# EAGLE design master_jorge3newIMU (EAGLE 7.1.0)
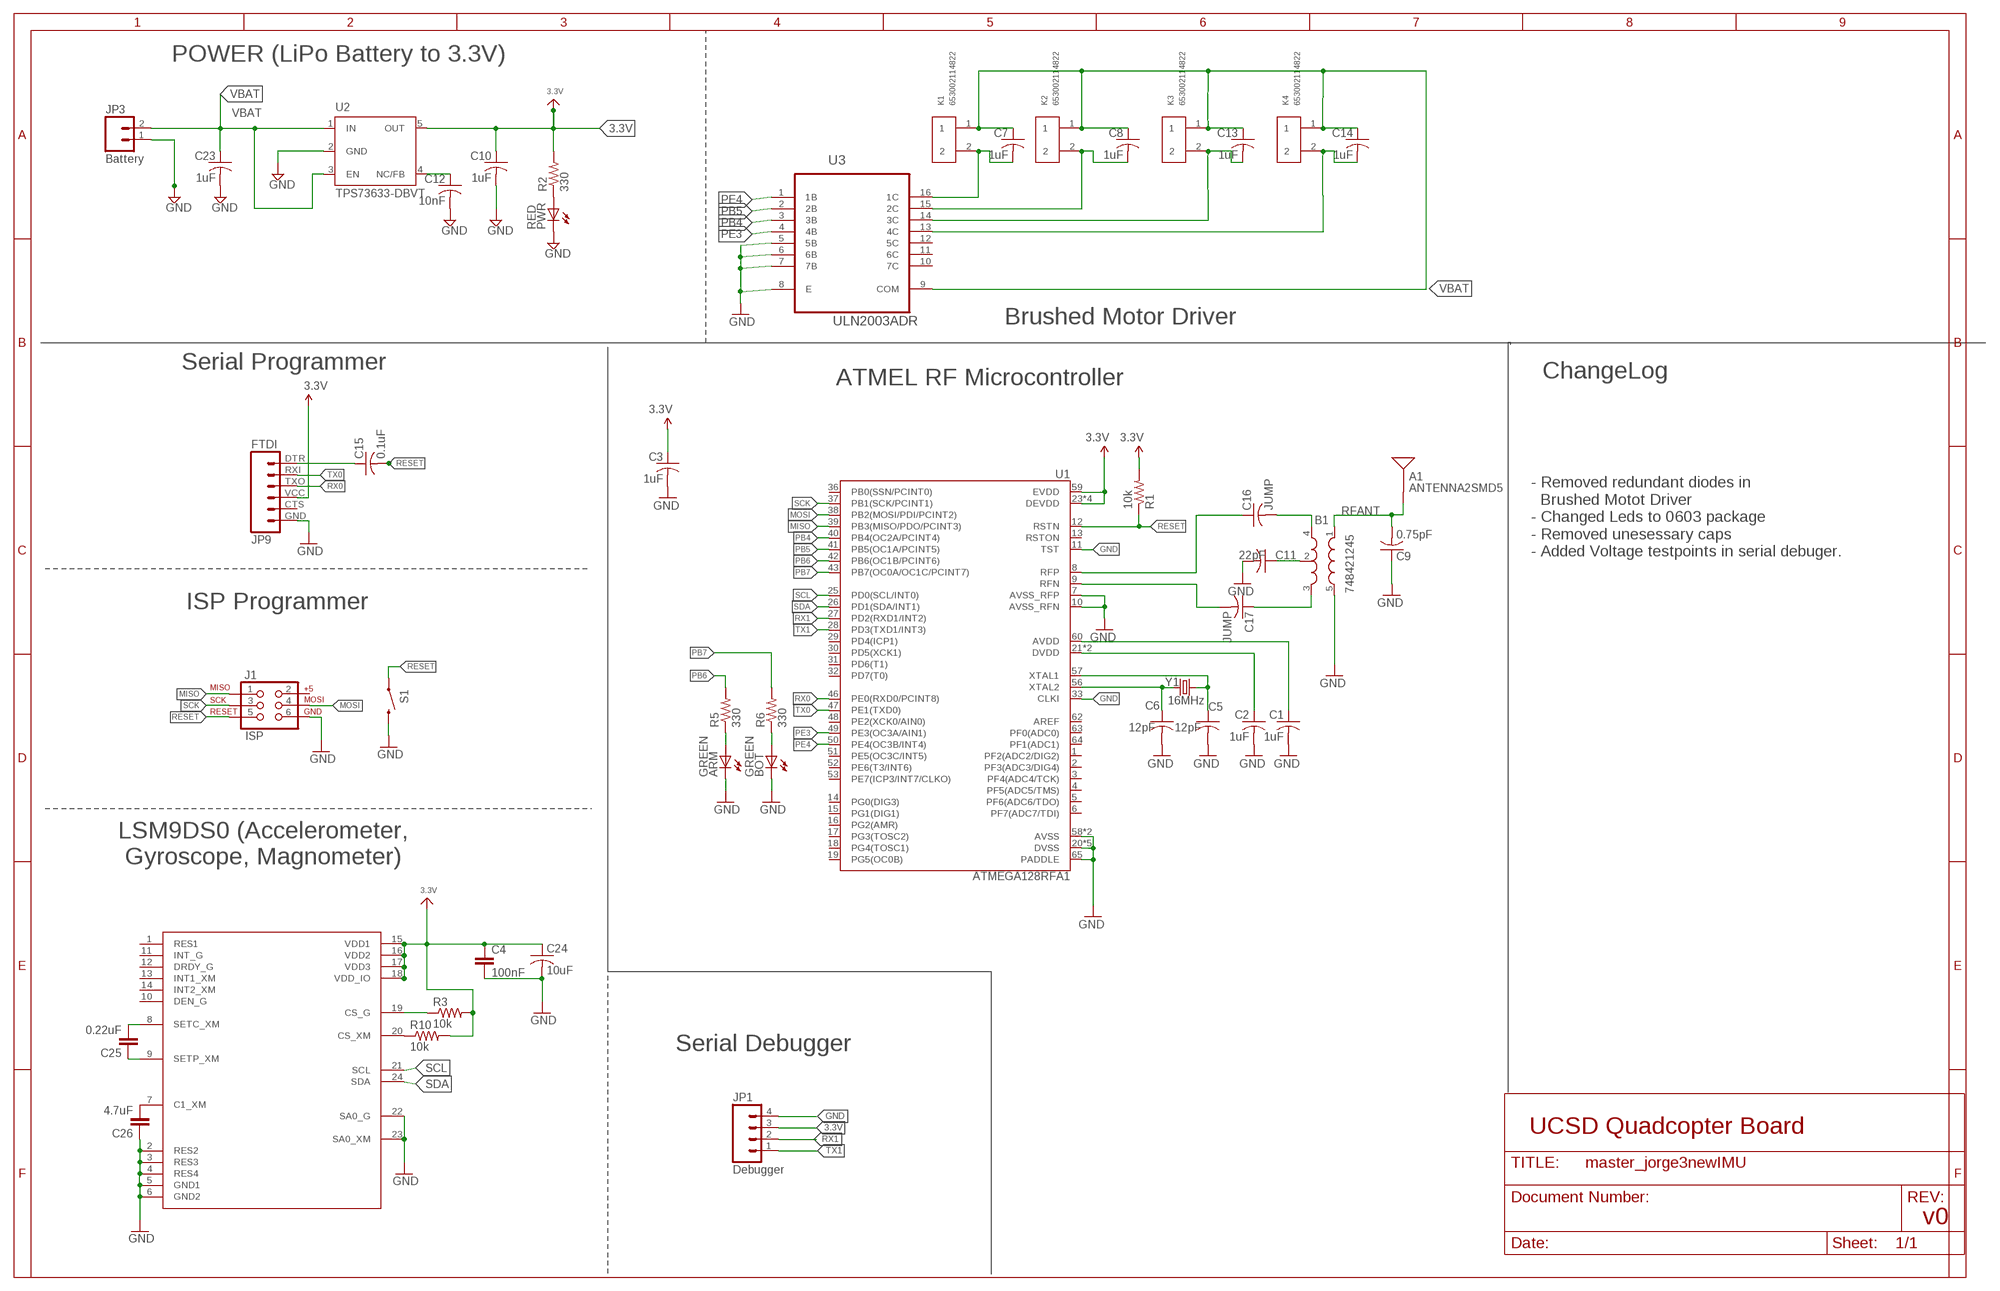
[diagram p0: schematic, sheet 1]

## Parts
A1  ANTENNA2SMD5  [ANTENNA-CHIP5]
ARM  GREEN  LEDCHIP-LED0805  [CHIP-LED0805]
B1  748421245  BALUN0805  [BALUN]
BOT  GREEN  LEDCHIP-LED0805  [CHIP-LED0805]
C1  1uF  C-USC0805  [C0805]
C2  1uF  C-USC0805  [C0805]
C3  1uF  C-USC0805  [C0805]
C4  100nF  CAP0805  [0805]
C5  12pF  C-USC0805  [C0805]
C6  12pF  C-USC0805  [C0805]
C7  1uF  C-USC0805  [C0805]
C8  1uF  C-USC0805  [C0805]
C9  0.75pF  C-USC0805  [C0805]
C10  1uF  C-USC0805  [C0805]
C11  22pF  C-USC0805  [C0805]
C12  10nF  C-USC0805  [C0805]
C13  1uF  C-USC0805  [C0805]
C14  1uF  C-USC0805  [C0805]
C15  0.1uF  C-USC0805  [C0805]
C16  JUMP  C-USC0805  [C0805]
C17  JUMP  C-USC0805  [C0805]
C23  1uF  C-USC0805  [C0805]
C24  10uF  C-USC0805  [C0805]
C25  0.22uF  CAP0805  [0805]
C26  4.7uF  CAP0805  [0805]
J1  ISP  AVR_SPI_PRG_6NS  [2X3-NS]
JP1  Debugger  M04PTH  [1X04]
JP3  Battery  M02PTH  [1X02]
JP9  FTDI  FTDI_BASICPTH  [FTDI_BASIC]
K1  653002114822  [653002114822]
K2  653002114822  [653002114822]
K3  653002114822  [653002114822]
K4  653002114822  [653002114822]
PWR  RED  LEDCHIP-LED0805  [CHIP-LED0805]
R1  10k  R-US_R0805  [R0805]
R2  330  R-US_R0805  [R0805]
R3  10k  RESISTOR0805-RES  [0805]
R5  330  R-US_R0805  [R0805]
R6  330  R-US_R0805  [R0805]
R10  10k  RESISTOR0805-RES  [0805]
S1  SWITCH-MOMENTARY-2SMD  [TACTILE_SWITCH_SMD]
U1  ATMEGA128RFA1  [QFN-64]
U2  TPS73633-DBVT  [SOT23-DBV]
U3  ULN2003ADR  [SOIC127P600X175-16N]
U4  LSM9DS0  [LGA-24]
Y1  16MHz  CRYSTAL5X3  [CRYSTAL-SMD-5X3]

## Nets
3.3V: C3.1 C4.1 C10.1 C24.1 JP1.3 JP9.VCC R1.2 R2.2 R3.2 R10.2 U1.23(DEVDD) U1.34(DEVDD) U1.44(DEVDD) U1.54(DEVDD) U1.59(EVDD) U2.5(OUT) U4.15(VDD1) U4.16(VDD2) U4.17(VDD3) U4.18(VDD_IO)
AVDD: C1.1 U1.60(AVDD)
DTR: C15.1 JP9.DTR
DVDD: C2.1 U1.21(DVDD) U1.22(DVDD)
GND: ARM.C B1.5(GND) BOT.C C1.2 C2.2 C3.2 C4.2 C5.2 C6.2 C9.1 C10.2 C11.2 C12.2 C23.2 C24.2 C26.1 J1.6 JP1.4 JP3.1 JP9.GND PWR.C S1.3 U1.7(AVSS_RFP) U1.10(AVSS_RFN) U1.11(TST) U1.20(DVSS) U1.24(DVSS) U1.33(CLKI) U1.35(DVSS) U1.45(DVSS) U1.55(DVSS) U1.58(AVSS) U1.61(AVSS) U1.65(PADDLE) U2.2(GND) U3.5(5B) U3.6(6B) U3.7(7B) U3.8(E) U4.2(RES2) U4.3(RES3) U4.4(RES4) U4.5(GND1) U4.6(GND2) U4.22(SA0_G) U4.23(SA0_XM)
MISO: J1.1 U1.39(PB3(MISO/PDO/PCINT3))
MOSI: J1.4 U1.38(PB2(MOSI/PDI/PCINT2))
N$1: C12.1 U2.4(NC/FB)
N$2: PWR.A R2.1
N$3: C5.1 U1.57(XTAL1) Y1.3
N$4: C6.1 U1.56(XTAL2) Y1.1
N$7: B1.2(GND) C11.1
N$8: ARM.A R5.1
N$10: B1.4(OUT1) C16.2
N$11: B1.3(OUT2) C17.1
N$13: BOT.A R6.1
N$20: C26.2 U4.7(C1_XM)
N$21: C25.2 U4.8(SETC_XM)
N$22: C25.1 U4.9(SETP_XM)
N$23: R3.1 U4.19(CS_G)
N$24: R10.1 U4.20(CS_XM)
N$29: C7.2 K1.2 U3.16(1C)
N$30: C8.2 K2.2 U3.15(2C)
N$31: C13.2 K3.2 U3.14(3C)
N$32: C14.2 K4.2 U3.13(4C)
PB4: U1.40(PB4(OC2A/PCINT4)) U3.3(3B)
PB5: U1.41(PB5(OC1A/PCINT5)) U3.2(2B)
PB6: R5.2 U1.42(PB6(OC1B/PCINT6))
PB7: R6.2 U1.43(PB7(OC0A/OC1C/PCINT7))
PE3: U1.49(PE3(OC3A/AIN1)) U3.4(4B)
PE4: U1.50(PE4(OC3B/INT4)) U3.1(1B)
RESET: C15.2 J1.5 R1.1 S1.1 U1.12(RSTN)
RFANT [RFSIG]: A1.FEED(SIGNAL) B1.1(IN) C9.2
RFN: C17.2 U1.9(RFN)
RFP: C16.1 U1.8(RFP)
RX0: JP9.TXO U1.46(PE0(RXD0/PCINT8))
RX1: JP1.2 U1.27(PD2(RXD1/INT2))
SCK: J1.3 U1.37(PB1(SCK/PCINT1))
SCL: U1.25(PD0(SCL/INT0)) U4.21(SCL)
SDA: U1.26(PD1(SDA/INT1)) U4.24(SDA)
TX0: JP9.RXI U1.47(PE1(TXD0))
TX1: JP1.1 U1.28(PD3(TXD1/INT3))
VBAT: C7.1 C8.1 C13.1 C14.1 C23.1 JP3.2 K1.1 K2.1 K3.1 K4.1 U2.1(IN) U2.3(EN) U3.9(COM)
Unconnected: J1.2 JP9.CTS U1.1(PF2(ADC2/DIG2)) U1.2(PF3(ADC3/DIG4)) U1.3(PF4(ADC4/TCK)) U1.4(PF5(ADC5/TMS)) U1.5(PF6(ADC6/TDO)) U1.6(PF7(ADC7/TDI)) U1.13(RSTON) U1.14(PG0(DIG3)) U1.15(PG1(DIG1)) U1.16(PG2(AMR)) U1.17(PG3(TOSC2)) U1.18(PG4(TOSC1)) U1.19(PG5(OC0B)) U1.29(PD4(ICP1)) U1.30(PD5(XCK1)) U1.31(PD6(T1)) U1.32(PD7(T0)) U1.36(PB0(SSN/PCINT0)) U1.48(PE2(XCK0/AIN0)) U1.51(PE5(OC3C/INT5)) U1.52(PE6(T3/INT6)) U1.53(PE7(ICP3/INT7/CLKO)) U1.62(AREF) U1.63(PF0(ADC0)) U1.64(PF1(ADC1)) U3.10(7C) U3.11(6C) U3.12(5C) U4.1(RES1) U4.10(DEN_G) U4.11(INT_G) U4.12(DRDY_G) U4.13(INT1_XM) U4.14(INT2_XM)

## Notes on the sheet
- POWER (LiPo Battery to 3.3V)
- Brushed Motor Driver
- Serial Programmer
- ATMEL RF Microcontroller | ChangeLog
- - Removed redundant diodes in 
    Brushed Motot Driver
  - Changed Leds to 0603 package
  - Removed unesessary caps
  - Added Voltage testpoints in serial debuger.
- ISP Programmer
- LSM9DS0 (Accelerometer,
   Gyroscope, Magnometer)
- Serial Debugger
- UCSD Quadcopter Board
- v0

## Library data of the parts
A1 = SparkFun-RF:ANTENNA2: Chip antenna Single endded antenna. Common with smaller chip antennas. CHIP4 package is the GPS Chip Antenna SKU: GPS-08418. CHIP5 package is 2.4GHz chip antenna SKU: WRL-00144.
ARM BOT PWR = led:LED: LED OSRAM: - CHIPLED LG R971, LG N971, LY N971, LG Q971, LY Q971, LO R971, LY R971 LH N974, LH R974 LS Q976, LO Q976, LY Q976 LO Q996 - Hyper CHIPLED LW Q18S LB Q993, LB Q99A, LB R99A - SideLED LS A670, LO A670, LY A670, LG A670, LP A670 LB A673, LV A673, LT A673, LW A673 LH A674 LY A675 LS A676, LA A676, LO A676, LY A676, LW A676 LS A679, LY A679, LG A679 - Hyper Micro SIDELED® LS Y876, LA Y876, LO Y876, LY Y876 LT Y87S - SmartLED LW L88C, LW L88S LB L89C, LB L89S, LG L890 LS L89K, LO L89K, LY L89K LS L896, LA L896, LO L896, LY L896 - TOPLED LS T670, LO T670, LY T670, LG T670, LP T670 LSG T670, LSP T670, LSY T670, LOP T670, LYG T670 LG T671, LOG T671, LSG T671 LB T673, LV T673, LT T673, LW T673 LH T674 LS T676, LA T676, LO T676, LY T676, LB T676, LH T676, LSB T676, LW T676 LB T67C, LV T67C, LT T67C, LS T67K, LO T67K, LY T67K, LW E67C LS E67B, LA E67B, LO E67B, LY E67B, LB E67C, LV E67C, LT E67C LW T67C LS T679, LY T679, LG T679 LS T770, LO T770, LY T770, LG T770, LP T770 LB T773, LV T773, LT T773, LW T773 LH T774 LS E675, LA E675, LY E675, LS T675 LS T776, LA T776, LO T776, LY T776, LB T776 LHGB T686 LT T68C, LB T68C - Hyper Mini TOPLED® LB M676 - Mini TOPLED Santana® LG M470 LS M47K, LO M47K, LY M47K Source: http://www.osram.convergy.de LUXEON: - LUMILED® LXK2-PW12-R00, LXK2-PW12-S00, LXK2-PW14-U00, LXK2-PW14-V00 LXK2-PM12-R00, LXK2-PM12-S00, LXK2-PM14-U00 LXK2-PE12-Q00, LXK2-PE12-R00, LXK2-PE12-S00, LXK2-PE14-T00, LXK2-PE14-U00 LXK2-PB12-K00, LXK2-PB12-L00, LXK2-PB12-M00, LXK2-PB14-N00, LXK2-PB14-P00, LXK2-PB14-Q00 LXK2-PR12-L00, LXK2-PR12-M00, LXK2-PR14-Q00, LXK2-PR14-R00 LXK2-PD12-Q00, LXK2-PD12-R00, LXK2-PD12-S00 LXK2-PH12-R00, LXK2-PH12-S00 LXK2-PL12-P00, LXK2-PL12-Q00, LXK2-PL12-R00 Source: www.luxeon.com KINGBRIGHT: KA-3528ASYC Source: www.kingbright.com
B1 = SparkFun-RF:BALUN: 0805 footprint balun- Ember 351/357
C1-C3 C5-C17 C23 = resistor:C-US: CAPACITOR, American symbol
C4 C25 C26 = SparkFun-Capacitors:CAP: Capacitor Standard 0603 ceramic capacitor, and 0.1" leaded capacitor.
C24 = rcl:C-US: CAPACITOR, American symbol
J1 = SparkFun-Connectors:AVR_SPI_PRG_6: AVR ISP 6 Pin This is the reduced ISP connector for AVR programming. Common on Arduino. This footprint will take up less PCB space and can be used with a 10-pin to 6-pin adapter such as SKU: BOB-08508
JP1 = SparkFun-Connectors:M04: Header 4 Standard 4-pin 0.1" header. Use with straight break away headers (SKU : PRT-00116), right angle break away headers (PRT-00553), swiss pins (PRT-00743), machine pins (PRT-00117), and female headers (PRT-00115). Molex polarized connector foot print use with SKU : PRT-08231 with associated crimp pins and housings. 1MM SMD Version SKU: PRT-10208
JP3 = SparkFun:M02: Header 2 Standard 2-pin 0.1" header. Use with straight break away headers (SKU : PRT-00116), right angle break away headers (PRT-00553), swiss pins (PRT-00743), machine pins (PRT-00117), and female headers (PRT-00115). Molex polarized connector foot print use with SKU : PRT-08233 with associated crimp pins and housings.
JP9 = SparkFun-Connectors:FTDI_BASIC: FTDI Basic header with labels
K1-K4 = Wuerth_Elektronik_eiCan_Wire_to_Board_Connectors:653002114822: WR-WTB 1.25mm Male Vertical Shrouded Header, 2 Pins=>Code : Con_WTB_1.25_PCB_THT_653002114822 <http://katalog.we-online.de/media/thumbs2/eican/thb_Con_WTB_1.25_PCB_THT_6530xx114822_pf2.jpg> Details see: http://katalog.we-online.de/en/em/653_0xx_114_822 Created 2014-06-06, Karrer Zheng 2014 (C) Würth Elektronik; OC_FARNELL: unknown
R1 R2 R5 R6 = resistor:R-US_: RESISTOR, American symbol
R3 R10 = SparkFun-Passives:RESISTOR: Resistor Basic schematic elements and footprints for 0603, 1206, and PTH resistors.
S1 = SparkFun-Electromechanical:SWITCH-MOMENTARY-2: Various NO switches- pushbuttons, reed, etc
U1 = SparkFun-DigitalIC:ATMEGA128RFA1: ATmega128RFA1 8-bit AVR Microcontroller with Low Power 2.4GHz Transceiver for ZigBee and IEEE 802.15.4
U2 = Power:TPS73633-DBVT
U3 = Texas Instruments_By_element14_Batch_1:ULN2003ADR: 8-BIT SHIFT REGISTERS WITH 3-STATE OUTPUT REGISTERS; MPN: ULN2003ADR; OC_FARNELL: 1470513; OC_NEWARK: 77C3560; PACKAGE: SOIC-16; SUPPLIER: TEXAS INSTRUMENTS
U4 = IMU_parts:LSM9DS0
Y1 = SparkFun-FreqCtrl:CRYSTAL: Various standard crystals. Proven footprints. Spark Fun Electronics SKU : COM-00534

## Net classes
1 RFSIG: width 0.457 mm, clearance 0.205 mm to class 0, clearance 0.205 mm

## Board
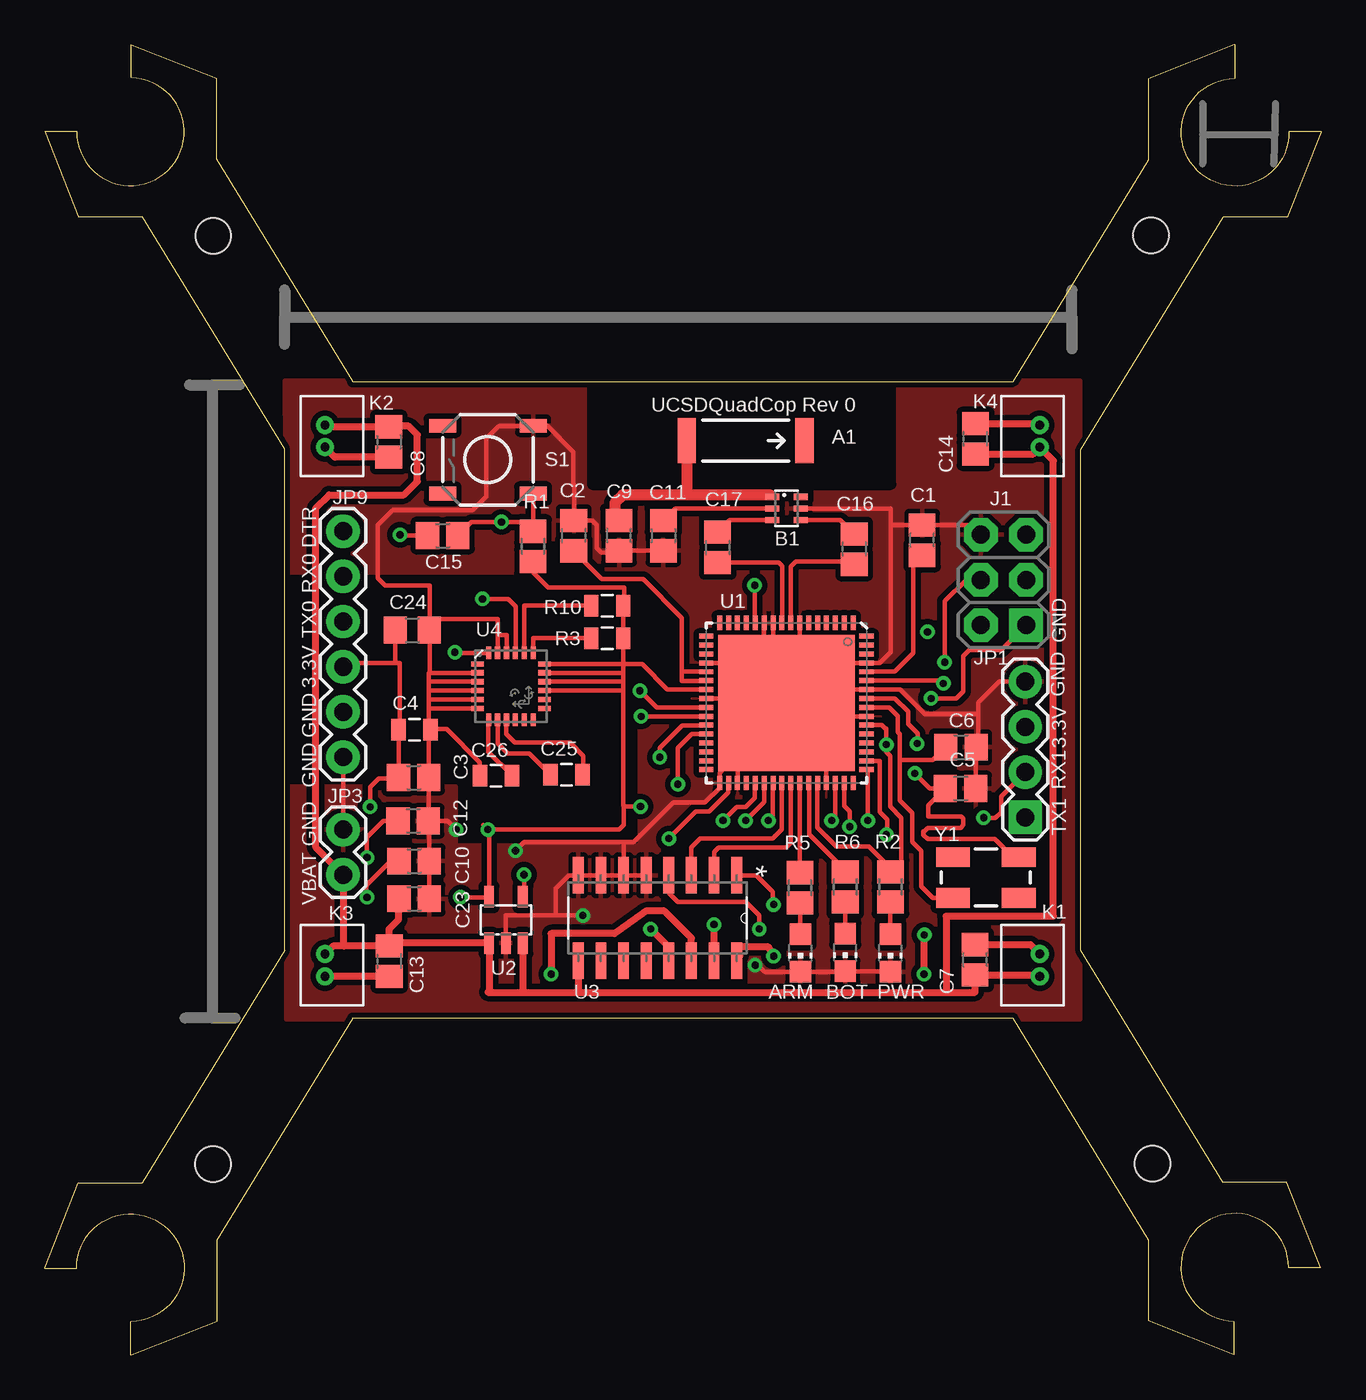
[diagram p1: board, top side]
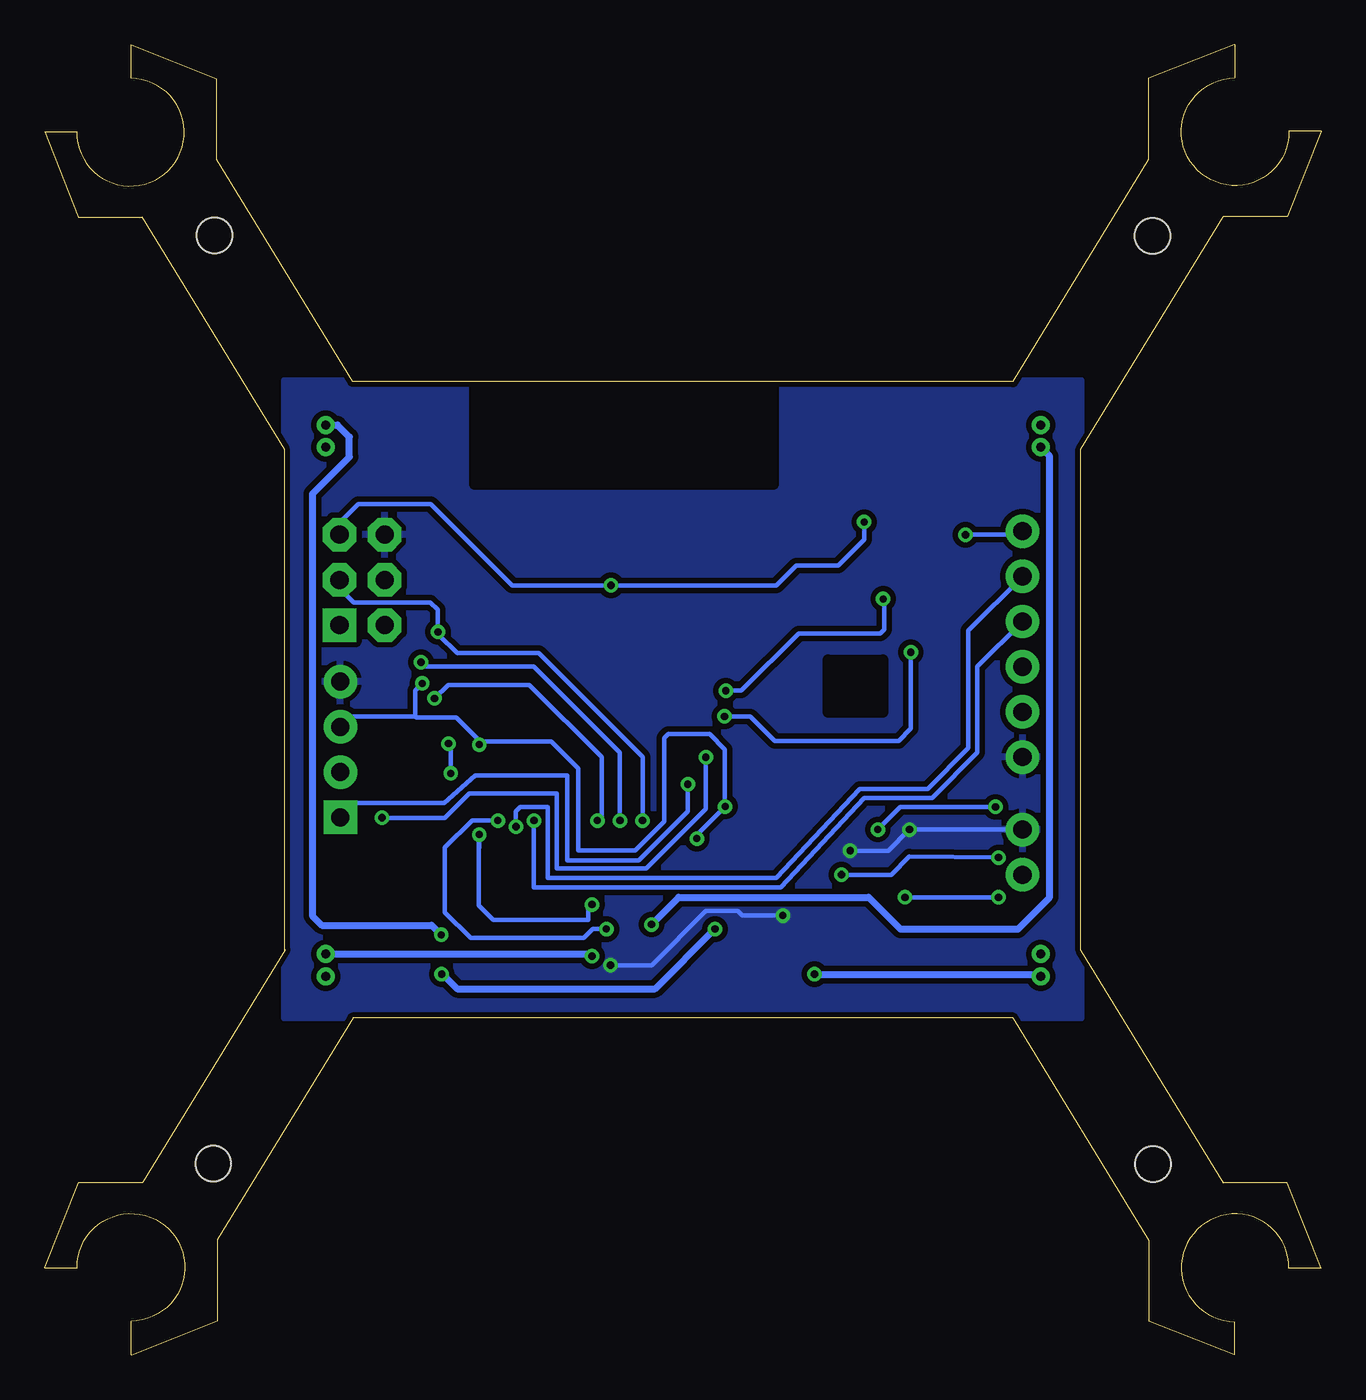
[diagram p2: board, bottom side, seen from below]

Size 71.68 x 73.61 mm. Coordinates in mm from the lower left corner, seen from the top.
Outline: 54.38,18.92 17.3,18.92 17.3,18.9 9.68,6.45 9.68,1.9 4.88,0 4.85,0 4.85,1.88 arc270 1.8,4.9 1.8,4.88 0,4.88 1.91,9.68 5.49,9.68 13.49,22.73 13.49,50.88 5.49,63.93 1.91,63.93 0,68.73 1.8,68.73 1.8,68.71 arc270 4.85,71.73 4.85,73.61 4.88,73.61 9.68,71.7 9.68,67.16 17.3,54.71 17.3,54.66
Outline: 58.19,22.73 58.19,50.85 66.19,63.91 69.77,63.91 71.68,68.71 69.88,68.71 69.88,68.68 arc-270 66.83,71.7 66.83,73.58 66.8,73.58 62,71.68 62,67.13 54.38,54.69
Outline: 17.3,54.68 54.38,54.68
Outline: 54.36,18.92 61.98,6.48 61.98,1.93 66.78,0.02 66.8,0.02 66.8,1.9 arc-270 69.85,4.93 69.85,4.9 71.65,4.9 69.75,9.7 66.17,9.7 58.17,22.76
Copper layers (1*16): Top 0.035559375mm / dielectric 1.501140625mm / Bottom 0.035559375mm
Design rules "4pcb-33board *": minimum track width 8mil, minimum drill 15mil, track to track 6mil, track to pad 6mil, pad to pad 6mil, via to via 6mil, smd to smd 6mil, copper to edge 10mil, drill to drill 10mil, minimum pad ring 10mil, minimum via ring 8mil, stop-mask expansion 4mil, vias tented up to drill 0mil, thermal gap 10mil
Holes 2 mm at 9.45,10.72 62.2,10.74 9.47,62.86 62.13,62.89
tRestrict: area 30.8,48.9 to 35.3,54.5; area 36.9,48.9 to 41.9,54.5; area 43.2,48.9 to 47.5,54.5; area 35.3,53 to 36.9,54.5; area 41.9,53 to 43.2,54.5; area 41.9,48.9 to 43.2,49.9
bRestrict: area 35.3,48.9 to 36.9,53; area 30.8,48.9 to 35.3,54.5; area 35.3,53 to 36.9,54.5; area 36.9,48.9 to 41.9,54.5; area 41.9,53 to 43.2,54.5; area 43.2,48.9 to 47.5,54.5; area 41.9,48.9 to 43.2,49.9; area 24.6,36.1 to 27.7,39

### Footprints (pad centres in the part's own frame; a part is rotated, then mirrored left to right if it is on the bottom)
ANTENNA-CHIP5 = smd 1.016 x 2.54: FEED -3.302,0; NC 3.302,0
CHIP-LED0805 = smd 1.2 x 1.2: A 0,-1.05; C 0,1.05
BALUN = smd 0.35 x 0.8: 1 -0.65,-0.8; 2 0,-0.8; 3 0.65,-0.8; 4 0.65,0.8; 5 0,0.8; 6 -0.65,0.8
C0805 = smd 1.3 x 1.5: 1 -0.85,0; 2 0.85,0
0805 = smd 0.8 x 1.2: 1 -0.9,0; 2 0.9,0
C0805' = smd 1.3 x 1.5: 1 -0.95,0; 2 0.95,0
2X3-NS = drill 1.016 pad 1.88 square: 1 -2.54,-1.27 | drill 1.016 pad 1.88 octagon: 2 -2.54,1.27; 3 0,-1.27; 4 0,1.27; 5 2.54,-1.27; 6 2.54,1.27
1X04 = drill 1.016 pad 1.88 square: 1 0,0 | drill 1.016 pad 1.88: 2 2.54,0; 3 5.08,0; 4 7.62,0
1X02 = drill 1.016 pad 1.88: 1 0,0; 2 2.54,0
FTDI_BASIC = drill 1.016 pad 1.88: CTS 10.16,0; DTR 0,0; GND 12.7,0; RXI 2.54,0; TXO 5.08,0; VCC 7.62,0
653002114822 = drill 0.5: 1 0.625,0; 2 -0.625,0
R0805 = smd 1.3 x 1.5: 1 -0.85,0; 2 0.85,0
TACTILE_SWITCH_SMD = smd 1.524 x 0.762: 1 -2.54,1.905; 2 2.54,1.905; 3 -2.54,-1.905; 4 2.54,-1.905
QFN-64 = smd 0.8 x 0.28: 1 -4.5,3.75; 2 -4.5,3.25; 3 -4.5,2.75; 4 -4.5,2.25; 5 -4.5,1.75; 6 -4.5,1.25; 7 -4.5,0.75; 8 -4.5,0.25; 9 -4.5,-0.25; 10 -4.5,-0.75; 11 -4.5,-1.25; 12 -4.5,-1.75; 13 -4.5,-2.25; 14 -4.5,-2.75; 15 -4.5,-3.25; 16 -4.5,-3.75; 33 4.5,-3.75; 34 4.5,-3.25; 35 4.5,-2.75; 36 4.5,-2.25; 37 4.5,-1.75; 38 4.5,-1.25; 39 4.5,-0.75; 40 4.5,-0.25; 41 4.5,0.25; 42 4.5,0.75; 43 4.5,1.25; 44 4.5,1.75; 45 4.5,2.25; 46 4.5,2.75; 47 4.5,3.25; 48 4.5,3.75 | smd 0.28 x 0.8: 17 -3.75,-4.5; 18 -3.25,-4.5; 19 -2.75,-4.5; 20 -2.25,-4.5; 21 -1.75,-4.5; 22 -1.25,-4.5; 23 -0.75,-4.5; 24 -0.25,-4.5; 25 0.25,-4.5; 26 0.75,-4.5; 27 1.25,-4.5; 28 1.75,-4.5; 29 2.25,-4.5; 30 2.75,-4.5; 31 3.25,-4.5; 32 3.75,-4.5; 49 3.75,4.5; 50 3.25,4.5; 51 2.75,4.5; 52 2.25,4.5; 53 1.75,4.5; 54 1.25,4.5; 55 0.75,4.5; 56 0.25,4.5; 57 -0.25,4.5; 58 -0.75,4.5; 59 -1.25,4.5; 60 -1.75,4.5; 61 -2.25,4.5; 62 -2.75,4.5; 63 -3.25,4.5; 64 -3.75,4.5 | smd 7.65 x 7.65: 65 0,0
SOT23-DBV = smd 0.55 x 1.2: 1 -0.95,-1.3; 2 0,-1.3; 3 0.95,-1.3; 4 0.95,1.3; 5 -0.95,1.3
SOIC127P600X175-16N = smd 2.057 x 0.61: 1 -4.801,8.89; 2 -4.801,7.62; 3 -4.801,6.35; 4 -4.801,5.08; 5 -4.801,3.81; 6 -4.801,2.54; 7 -4.801,1.27; 8 -4.801,0; 9 0,0; 10 0,1.27; 11 0,2.54; 12 0,3.81; 13 0,5.08; 14 0,6.35; 15 0,7.62; 16 0,8.89
LGA-24 = smd 0.7 x 0.29: 1 -1.875,1.25; 2 -1.875,0.75; 3 -1.875,0.25; 4 -1.875,-0.25; 5 -1.875,-0.75; 6 -1.875,-1.25; 13 1.875,-1.25; 14 1.875,-0.75; 15 1.875,-0.25; 16 1.875,0.25; 17 1.875,0.75; 18 1.875,1.25 | smd 0.29 x 0.7: 7 -1.25,-1.875; 8 -0.75,-1.875; 9 -0.25,-1.875; 10 0.25,-1.875; 11 0.75,-1.875; 12 1.25,-1.875; 19 1.25,1.875; 20 0.75,1.875; 21 0.25,1.875; 22 -0.25,1.875; 23 -0.75,1.875; 24 -1.25,1.875
CRYSTAL-SMD-5X3 = smd 1.9 x 1.1: 1 -1.85,-1.15; 2 1.85,-1.15; 3 1.85,1.15; 4 -1.85,1.15

### Placement (x,y rotation side)
A1  39.37,51.36 0 top
ARM  42.44,22.58 180 top
B1  41.66,47.55 270 top
BOT  44.96,22.61 180 top
C1  49.28,45.77 90 top
C2  29.72,46.02 90 top
C3  20.73,32.44 0 top
C4  20.78,35.13 0 top
C5  51.44,31.83 0 top
C6  51.46,34.14 0 top
C7  52.25,22.2 90 top
C8  19.33,51.28 270 top
C9  32.26,46.02 90 top
C10  20.75,27.74 0 top
C11  34.75,46.02 270 top
C12  20.7,30 0 top
C13  19.35,22.12 270 top
C14  52.27,51.46 90 top
C15  22.35,46.02 0 top
C16  45.47,45.26 90 top
C17  37.8,45.36 270 top
C23  20.75,25.63 0 top
C24  10uF  [C0805']  20.65,40.72 0 top
C25  29.31,32.59 180 top
C26  25.35,32.54 0 top
J1  53.85,43.54 90 top
JP1  55.07,30.2 90 top
JP3  16.76,29.51 270 top
JP9  16.76,46.28 270 top
K1  55.88,21.89 270 top
K2  15.75,51.61 90 top
K3  15.75,21.89 90 top
K4  55.88,51.61 270 top
PWR  47.5,22.58 180 top
R1  27.43,45.42 270 top
R2  47.5,26.29 90 top
R3  31.6,40.26 0 top
R5  42.42,26.24 90 top
R6  44.96,26.29 90 top
R10  31.6,42.09 0 top
S1  24.89,50.29 180 top
U1  41.66,36.63 270 top
U2  25.91,24.43 0 top
U3  29.97,22.15 270 top
U4  26.19,37.57 0 top
Y1  52.86,26.82 0 top

### Tracks (layer width: path | path; a pad name or v marks a point on that pad's centre or on a via)
3.3V  (via drill 0.41)
  Top 0.254: U1.59 46.18,37.9 50.29,37.9 v50.47,37.72 | 32.51,30.82 32.51,29.77 32.26,29.52 v24.89,29.52 | 24.64,29.77 v24.89,29.52 | v24.89,29.52 24.96,29.45 U2.5 24.93,25.7 v23.37,25.7 | U1.54 47.02,35.38 47.22,35.18 47.27,35.18 v47.27,34.29 47.27,33.88 47.5,33.66 47.5,30.81 48.11,30.17 48.11,27.27 R2.2 47.5,27.36 46.28,28.57 44.45,28.57 43.38,29.64 43.38,32.11 | U1.34 38.4,31.6 37.34,30.53 36.58,30.53 v35.05,29.01 | 43.38,32.13 U1.44 43.38,32.11 | 43.38,32.23 43.38,32.11 | v33.46,30.81 32.53,30.81 32.51,30.82 | 27.36,45.1 R1.2 27.43,43.94 28.27,43.1 32.54,43.1 32.54,42.13 R10.2 R3.2 32.5,38.82 | 19.69,38.86 19.94,38.86 19.94,35.19 C4.1 C3.1 | 19.69,38.86 16.76,38.86 JP9.VCC | 32.5,38.82 32.5,38.32 | 32.5,38.32 32.5,37.82 | 32.5,37.82 32.5,37.32 | 32.5,37.32 32.5,30.84 32.51,30.82 | U4.18 32.5,38.82 | U4.17 32.5,38.32 | U4.16 32.5,37.82 | U4.15 32.5,37.32 | U1.23 37.14,37.39 34.98,37.39 33.55,38.82 32.5,38.82 | C3.1 | C3.1 19.88,32.37 18.76,32.37 18.29,31.9 v18.29,30.78 | C10.1 19.43,27.74 18.06,26.36 18.06,25.76 v18.11,25.7 | C24.1 19.7,38.88 19.69,38.86
  Bottom 0.254: v18.29,30.78 23.62,30.78 v24.89,29.52 | v18.11,25.7 v23.37,25.7 | v35.05,29.01 35.05,29.21 v33.46,30.81 33.49,30.84 33.49,34.02 34.34,34.87 36.65,34.87 36.88,34.65 36.88,29.97 38.51,28.35 41.71,28.35 41.71,32.94 43.23,34.47 47.09,34.47 v47.27,34.29 47.27,34.52 48.56,35.81 50.8,35.81 50.85,35.86 | v50.47,37.72 50.85,37.34 50.85,35.86 | 50.85,35.86 54.48,35.86 JP1.3
AVDD
  Top 0.254: U1.60 46.18,38.41 47.75,38.41 48.77,39.42 48.77,44.41 C1.1
DTR  (via drill 0.41)
  Top 0.254: C15.1 20.02,46.02 v19.96,46.08
  Bottom 0.254: v19.96,46.08 16.97,46.08 JP9.DTR
DVDD
  Top 0.254: C2.1 29.72,45.16 31.29,43.59 33.6,43.59 35.79,41.4 35.79,38.38 | U1.22 35.79,37.87 35.79,38.3 35.79,38.38 | U1.21 35.79,38.38
GND  (via drill 0.41)
  Top 0.254: U3.6 U3.7 U3.8 29.44,26.95 28.7,26.21 28.7,24.69 | U3.6 U3.5 | JP9.GND JP3.1 | U1.10 40.91,37.38 | 40.91,37.38 U1.65 | 40.91,37.38 40.41,36.88 39.07,36.88 | U1.7 42.41,38.88 | 42.41,38.88 40.91,37.38 | 42.41,38.88 U1.61 46.9,38.88 47.52,39.5 47.52,46.61 | U1.10 40.91,39.69 40.39,39.17 40.39,41.11 U1.11 | U1.10 40.91,39.16 41.4,38.66 39.12,38.66 38.86,38.91 38.83,38.88 U1.20 | U1.10 40.91,40.17 43.69,37.39 | 43.69,37.39 46.16,37.39 | U1.10 40.91,36.64 | 46.17,37.39 U1.58 46.16,37.39 | 47.5,21.39 PWR.C 47.47,21.56 BOT.C 44.93,21.53 ARM.C 42.43,21.51 40.44,21.51 40.06,21.89 v39.9,21.89 | v30.23,24.69 28.7,24.69 | U2.2 25.91,24.69 28.7,24.69 | U1.24 39.07,36.88 | 38.91,33.86 37.91,32.7 U1.33 37.91,31.86 37.08,31.04 35.31,31.04 33.78,29.52 33.09,28.82 32.39,28.82 | 38.91,33.86 39.12,34.09 39.12,36.83 39.07,36.88 | U1.45 43.91,35.88 | 43.91,35.88 43.91,37.17 43.69,37.39 | U1.55 43.91,35.88 | U1.35 38.91,33.86 | 46.16,37.39 48.06,37.39 49.43,36.02 52.43,36.02 | 32.39,28.82 26.94,28.82 v26.44,28.32 | C11.2 C9.1 32.17,45.08 31.27,45.08 31.01,45.34 31.01,46.61 30.75,46.88 C2.2 29.74,46.9 29.74,48.89 29.69,48.95 29.69,50.72 28.22,52.2 S1.3 27.15,52.2 27.13,52.17 25.5,52.17 24.82,51.49 24.82,48.21 24.05,47.45 19.56,47.45 18.72,46.61 18.72,43.64 19.13,43.23 21.64,43.23 21.64,41.35 | B1.5 47.52,47.55 47.52,46.61 | 47.52,46.61 47.54,46.62 C1.2 49.29,46.61 52.04,46.61 J1.6 | 24.31,38.35 U4.2 21.63,38.32 | U4.6 24.08,36.32 21.56,36.32 | 21.56,37.82 21.56,38.32 21.63,38.32 | 21.56,37.82 21.56,37.32 | 21.56,37.32 21.56,36.82 | 21.56,36.82 21.56,36.32 | U4.23 25.45,39.44 25.45,40.44 | U4.22 25.96,39.44 25.96,40.44 25.45,40.44
  Top 0.254: U4.5 21.56,36.82 | U4.4 21.56,37.32 | U4.3 21.56,37.82 | 21.64,41.35 25.45,41.35 25.45,40.44 | C26.1 24.45,33.28 22.58,35.15 21.7,35.15 C4.2 | 21.56,36.32 21.56,35.24 C4.2 | C4.2 21.58,35.03 C3.2 21.58,30.02 C12.2 | C23.2 C10.2 21.6,29.95 C12.2 | C12.2 22.63,30 v23.11,29.52 | 52.4,34.23 C6.2 | C5.2 52.29,34.11 C6.2 | JP1.4 53.59,37.82 52.43,36.65 52.43,36.02 | 52.43,36.02 52.43,34.25 C6.2 | 21.63,38.32 21.63,40.69 C24.2 21.64,40.76 21.64,41.35 | U3.6 32.51,28.7 32.39,28.82
  Bottom 0.254: JP3.1 v23.11,29.52 24.31,28.32 v26.44,28.32 | v30.23,24.69 32.51,24.69 32.77,24.94 34.54,24.94 37.59,21.89 v39.9,21.89
  pour Bottom (isolate 0.305): 13.49,54.74 13.49,18.92 58.19,18.92 58.19,54.74
  pour Top (isolate 0.305): 13.56,43.94 33.43,43.94 33.43,28.63 23.09,28.63 23.09,31.93 13.56,31.93 13.56,18.85 58.17,18.85 58.17,54.74 13.49,54.74 13.49,54.53
MISO  (via drill 0.41)
  Top 0.254: v40.64,30.02 40.89,30.28 40.89,32.11 U1.39 | v49.78,36.88 51.21,36.88 51.59,37.26 51.59,39.27 51.92,39.6 53.72,39.6 J1.1
  Bottom 0.254: v40.64,30.02 40.39,30.28 40.39,33.58 44.45,37.64 49.02,37.64 v49.78,36.88
MOSI  (via drill 0.41)
  Top 0.254: U1.38 40.41,31.06 v39.37,30.02 | v50.55,38.91 50.55,42.34 51.71,43.51 52.55,43.51 J1.4
  Bottom 0.254: v39.37,30.02 39.37,33.83 44.2,38.66 50.29,38.66 v50.55,38.91
N$1  (via drill 0.41)
  Top 0.254: v26.92,26.97 26.92,25.8 U2.4 | C12.1 19.02,30 18.08,29.06 18.08,27.96 v18.11,27.94
  Bottom 0.254: v18.11,27.94 23.11,27.99 24.13,26.97 v26.92,26.97
N$2
  Top 0.254: PWR.A R2.1
N$3  (via drill 0.41)
  Top 0.254: U1.57 47.75,36.88 48.49,36.14 48.49,35.43 49.02,34.9 49.02,34.37 v49,34.34 | Y1.3 54.37,27.97 53.37,28.98 49.58,28.98 49.35,29.21 49.35,29.41 49.4,29.41 49.61,29.62 51.44,29.62 51.59,29.77 51.59,30.12 51.46,30.25 49.63,30.25 49.63,30.87 C5.1 49.71,31.83 v48.87,32.66
  Bottom 0.254: v48.87,32.66 48.87,34.21 v49,34.34
N$4
  Top 0.254: U1.56 47.42,36.37 47.9,35.89 47.9,35 48.03,34.87 48.03,33.43 | C6.1 50.61,34.07 50.51,34.07 49.86,33.43 48.03,33.43 | 48.03,33.43 48.03,31.14 48.72,30.45 48.72,28.83 49.23,28.32 49.23,26.31 49.86,25.68 Y1.1
N$7
  Top 0.254: B1.2 35.42,47.55 C11.1
N$8
  Top 0.254: ARM.A 42.44,25.08 R5.1
N$10
  Top 0.254: 42.48,46.88 B1.4 44.68,46.9 C16.2
N$11
  Top 0.254: B1.3 38.48,46.9 C17.1
N$13
  Top 0.254: BOT.A R6.1
N$20
  Top 0.254: U4.7 24.92,35.69 24.92,33.87 C26.2
N$21
  Top 0.254: U4.8 25.44,34.35 26.01,33.78 27.22,33.78 C25.2
N$22
  Top 0.254: U4.9 25.94,34.87 26.42,34.39 29.51,34.39 30.25,33.66 30.25,32.63 C25.1
N$23
  Top 0.254: R3.1 27.44,40.26 U4.19
N$24
  Top 0.254: R10.1 26.94,42.09 U4.20
N$29  (via drill 0.41)
  Top 0.254: 39.12,22.4 U3.16
  Top 0.406: U3.16 38.86,22.91 40.64,22.91 v40.94,22.4 | C7.2 55.35,23.05 K1.2
  Bottom 0.254: 40.81,22.52 v40.94,22.4
  Bottom 0.406: K1.2 40.81,22.52
N$30  (via drill 0.41)
  Top 0.406: U3.15 v37.59,24.18 | C8.2 16.3,50.43 K2.2
  Bottom 0.406: v37.59,24.18 36.07,25.7 25.4,25.7 23.62,23.93 17.02,23.93 15.24,25.7 15.24,50.48 K2.2
N$31  (via drill 0.41)
  Top 0.406: U3.14 36.32,23.42 34.8,24.94 33.78,24.94 32,23.67 28.45,23.67 v28.45,21.39 | C13.2 K3.2
  Bottom 0.406: v28.45,21.39 15.87,21.39 K3.2
N$32  (via drill 0.41)
  Top 0.254: U3.13 35.05,22.91
  Top 0.406: 35.05,22.91 v34.04,23.93 | C14.2 55.81,52.31 K4.2 | v49.38,21.39 49.4,21.39 v49.4,23.6
  Bottom 0.406: K4.2 55.24,52.24 54.56,51.56 54.56,50.44 56.64,48.36 56.64,24.66 56.11,24.13 49.94,24.13 v49.4,23.6 | v49.38,21.39 49.33,21.39 48.51,20.57 37.39,20.57 v34.04,23.93
PB4
  Top 0.254: U3.3 36.32,28.5 36.83,29.01 40.89,29.01 41.4,29.52 U1.40
PB5
  Top 0.254: U3.2 37.59,28.24 37.85,28.5 41.66,28.5 41.91,28.75 U1.41
PB6
  Top 0.254: R5.2 42.42,32.11 U1.42
PB7
  Top 0.254: U1.43 42.93,32.11 42.93,29.23 44.96,27.2 R6.2
PE3  (via drill 0.41)
  Top 0.254: v46.23,30.02 46.23,32.8 U1.49 | U3.4 35.05,25.96 35.56,25.45 39.37,25.45 40.13,24.69 v40.13,23.93
  Bottom 0.254: v40.13,23.93 40.89,23.93 41.4,23.42 47.75,23.42 49.2,24.87 49.2,28.5 47.68,30.02 v46.23,30.02
PE4  (via drill 0.41)
  Top 0.254: U1.50 46.89,33.38 46.89,30.51 47.32,30.07 47.32,29.29 v47.27,29.23 | U3.1 39.96,26.95 40.89,26.02 40.89,25.36 v40.94,25.3
  Bottom 0.254: v40.94,25.3 41.15,25.1 41.15,24.43 46.48,24.43 47.29,25.25 47.29,29.21 v47.27,29.23 47.27,28.47
RESET  (via drill 0.41)
  Top 0.254: v39.88,43.23 39.88,41.16 U1.12 | S1.1 R1.1 27.34,46.79 v25.65,46.79 23.96,46.79 C15.2
  Bottom 0.254: v25.65,46.79 25.65,45.8 27.1,44.35 29.46,44.35 30.58,43.23 v39.88,43.23 45.42,43.23 49.99,47.8 54.08,47.8 55.17,46.71 55.17,46.13 J1.5
RFANT
  Top 0.254: 40.74,48.31 40.86,48.31 B1.1
  Top 0.61: A1.FEED 36.07,48.31 | 40.74,48.31 36.07,48.31 | 36.07,48.31 32.46,48.31 32.03,47.88 32.03,46.9 C9.2
RFN
  Top 0.254: U1.9 41.43,41.15 41.43,44.32 41.24,44.51 C17.2
RFP
  Top 0.254: U1.8 41.91,44.29 42.19,44.58 45.3,44.58 C16.1
RX0  (via drill 0.41)
  Top 0.254: U1.46 44.41,30.23 v44.2,30.02
  Bottom 0.254: JP9.TXO 19.3,38.66 19.3,33.83 21.84,31.29 25.65,31.29 30.35,26.26 44.2,26.26 v44.2,30.02
RX1  (via drill 0.41)
  Top 0.254: U1.27 37.14,35.36 35.81,35.36 34.54,34.09 v34.54,33.58 | v52.73,30.17 53.39,30.17 53.72,30.48 53.72,31.37 JP1.2
  Bottom 0.254: v34.54,33.58 34.54,30.68 37.9,27.33 42.93,27.33 42.93,31.55 47.83,31.55 49.2,30.17 v52.73,30.17
SCK  (via drill 0.41)
  Top 0.254: v38.1,30.02 38.86,30.78 39.37,30.78 39.88,31.29 39.88,32.1 U1.37
  Bottom 0.254: v38.1,30.02 38.1,33.58 43.94,39.42 48.51,39.42 49.53,40.44 v49.58,40.61 49.61,40.64 49.61,41.86 50.01,42.27 54.31,42.27 55.12,43.08 J1.3
SCL  (via drill 0.41)
  Top 0.254: U4.21 26.47,39.44 26.47,42.04 26.04,42.47 v24.59,42.47 | v33.43,37.31 34.36,36.38 U1.25
  Bottom 0.254: v24.59,42.47 24.54,42.42 24.54,40.74 24.74,40.54 29.34,40.54 32.56,37.31 v33.43,37.31
SDA  (via drill 0.41)
  Top 0.254: U4.24 23.07,39.44 v23.04,39.47 | v33.5,35.86 37.14,35.86 U1.26
  Bottom 0.254: v23.04,39.47 23.04,35.18 23.72,34.49 30.68,34.49 32.05,35.86 v33.5,35.86
TX0  (via drill 0.41)
  Top 0.254: U1.47 44.91,30.84 45.21,30.53 v45.21,29.67
  Bottom 0.254: v45.21,29.67 45.21,30.53 44.96,30.78 43.43,30.78 43.43,26.8 30.58,26.8 25.91,31.8 22.1,31.8 19.81,34.09 19.81,40.69 JP9.RXI
TX1  (via drill 0.41)
  Top 0.254: v35.56,32.05 35.56,34.09 36.35,34.88 U1.28
  Bottom 0.254: v35.56,32.05 35.56,30.53 38.3,27.79 42.34,27.79 42.34,32.56 47.5,32.56 49.23,31.01 54.28,31.01 JP1.1
VBAT
  Top 0.254: 29.97,21.13 U3.9 | 26.86,20.44 26.92,20.37 | 24.96,20.44 24.89,20.37
  Top 0.406: 24.89,20.37 26.92,20.37 29.97,20.37 | U3.9 29.97,20.37 | U2.3 26.86,20.44 | 24.96,20.44 U2.1 19.52,23.13 C13.1 | C14.1 55.5,50.61 K4.1 56.64,50.23 56.64,24.64 50.62,24.64 50.62,20.37 | K2.1 15.85,52.13 C8.1 19.37,52.17 20.45,52.17 20.93,51.69 20.93,49.07 20.17,48.31 15.98,48.31 15.24,47.57 15.24,28.5 JP3.2 16.76,23.02 16.81,22.97 | C13.1 16.81,22.97 | 16.81,22.97 16.2,22.97 K3.1 | C13.1 19.35,23.93 19.89,24.46 19.89,25.61 C23.1 | 29.97,20.37 50.62,20.37 | 50.62,20.37 52.25,20.37 C7.1 55.88,21.35 K1.1

### Text on the board
tPlace: UCSDQuadCop Rev 0 | DTR | RX0 | TX0 | GND | 3.3V | GND | GND | 3.3V | GND | RX1 | GND | TX1 | VBAT
tDocu: 0.238 inch / 6.045 mm | 2.90 inch / 73.66 mm | 1.4 inch / 35.56 mm | 1.41 inch / 35.81 mm | >Info / Board Name: UCSDQuadCop / Part Number: 0 / Number of Layers: 2 / Dimension X= 2.83 inch / Dimension Y= 2.90 inch / Board Material Type: FR-4 / Solder Mask Color: Red / Silkscreen Color: White / Finish Plating: HASAL / Revision Number: 0 | 2.83 inch / 71.88 mm